# EAGLE design BP_protection_board (EAGLE 9.7.0)
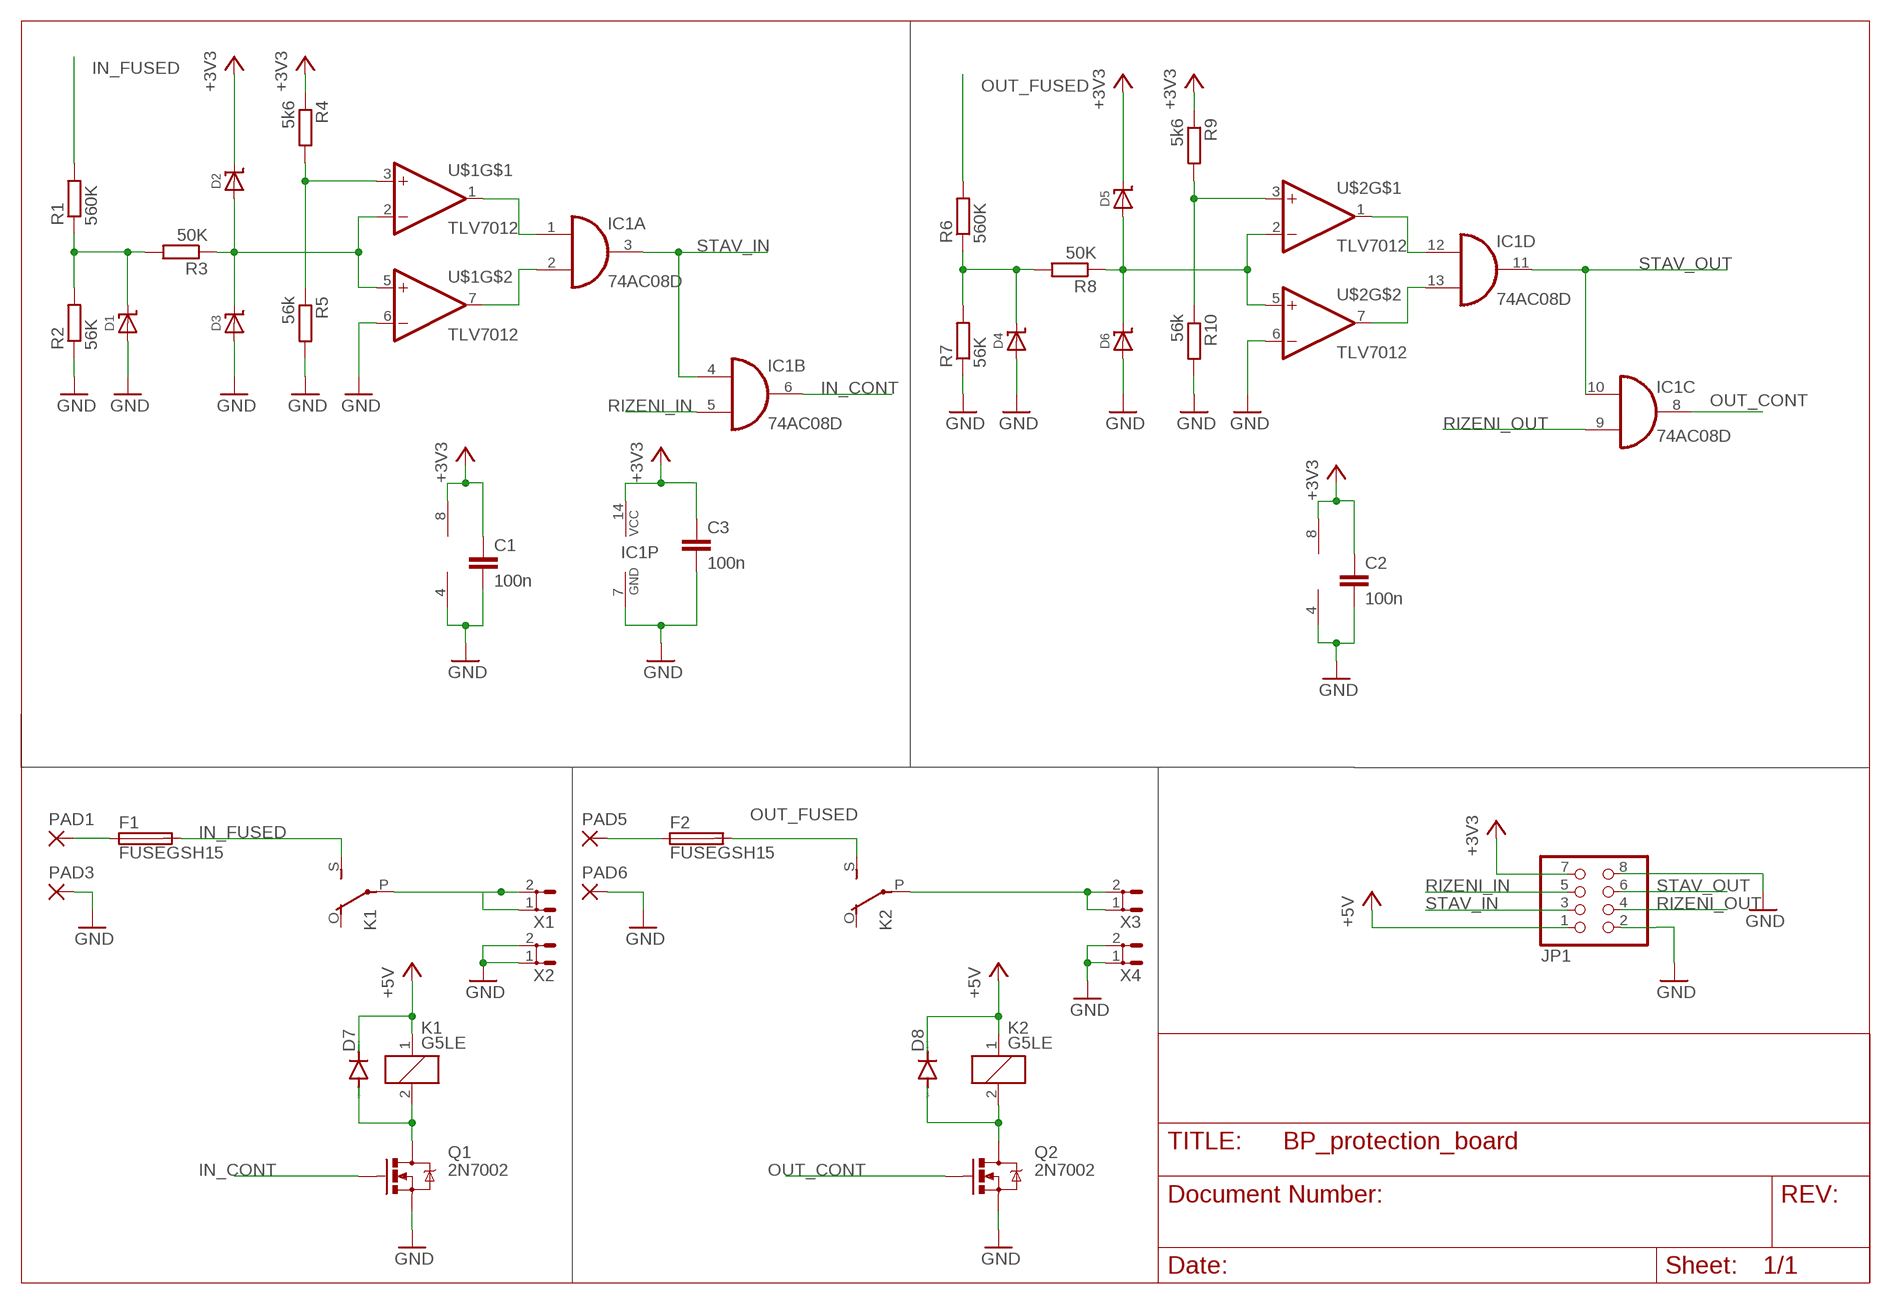
[diagram p0: schematic, sheet 1]

## Parts
C1  100n  C-EUC0805  [C0805]
C2  100n  C-EUC0805  [C0805]
C3  100n  C-EUC0805  [C0805]
D1  DIODE-SCHOTTKYSOD-123  [SOD-123]
D2  DIODE-SCHOTTKYSOD-123  [SOD-123]
D3  DIODE-SCHOTTKYSOD-123  [SOD-123]
D4  DIODE-SCHOTTKYSOD-123  [SOD-123]
D5  DIODE-SCHOTTKYSOD-123  [SOD-123]
D6  DIODE-SCHOTTKYSOD-123  [SOD-123]
D7  DIODE-MELF-MLL41  [MELF-MLL41]
D8  DIODE-MELF-MLL41  [MELF-MLL41]
F1  FUSEGSH15  [GSH15]
F2  FUSEGSH15  [GSH15]
IC1  74AC08D  [SO14]
JP1  PINHD-2X4  [2X04]
K1  G5LE  [G5LE]
K2  G5LE  [G5LE]
PAD1  2,54/1,0  [2,54/1,0]
PAD3  2,54/1,0  [2,54/1,0]
PAD5  2,54/1,0  [2,54/1,0]
PAD6  2,54/1,0  [2,54/1,0]
Q1  2N7002  MOSFET-NCHANNEL2N7002PW  [SOT323]
Q2  2N7002  MOSFET-NCHANNEL2N7002PW  [SOT323]
R1  560K  R-EU_R0805  [R0805]
R2  56K  R-EU_R0805  [R0805]
R3  50K  R-EU_R0805  [R0805]
R4  5k6  R-EU_R0805  [R0805]
R5  56k  R-EU_R0805  [R0805]
R6  560K  R-EU_R0805  [R0805]
R7  56K  R-EU_R0805  [R0805]
R8  50K  R-EU_R0805  [R0805]
R9  5k6  R-EU_R0805  [R0805]
R10  56k  R-EU_R0805  [R0805]
U$1  TLV7012  [SOT-23-THIN]
U$2  TLV7012  [SOT-23-THIN]
X1  ST6,3  [ST6,3]
X2  ST6,3  [ST6,3]
X3  ST6,3  [ST6,3]
X4  ST6,3  [ST6,3]

## Nets
+3V3: C1.1 C2.1 C3.1 D2.C D5.C IC1.14(P:VCC) JP1.7 R4.1 R9.1 U$1.8(V+) U$2.8(V+)
+5V: D7.C D8.C JP1.1 K1.1 K2.1
GND: C1.2 C2.2 C3.2 D1.A D3.A D4.A D6.A IC1.7(P:GND) JP1.2 JP1.8 PAD3.1(P) PAD6.1(P) Q1.2(S) Q2.2(S) R2.1 R5.2 R7.1 R10.2 U$1.4(V-) U$1.6(-IN) U$2.4(V-) U$2.6(-IN) X2.1 X2.2 X4.1 X4.2
IN_CONT: IC1.6(B:O) Q1.1(G)
IN_FUSED: F1.2 K1.S(2:S) R1.2
N$1: D1.C R1.1 R2.2 R3.2
N$2: D2.A D3.C R3.1 U$1.2(-IN) U$1.5(+IN)
N$3: R4.2 R5.1 U$1.3(+IN)
N$4: D4.C R6.1 R7.2 R8.2
N$5: F1.1 PAD1.1(P)
N$6: D5.A D6.C R8.1 U$2.2(-IN) U$2.5(+IN)
N$7: R9.2 R10.1 U$2.3(+IN)
N$8: K1.P(2:P) X1.1 X1.2
N$9: K2.P(2:P) X3.1 X3.2
N$10: D8.A K2.2 Q2.3(D)
N$11: D7.A K1.2 Q1.3(D)
N$12: IC1.1(A:I0) U$1.1(OUT)
N$13: IC1.2(A:I1) U$1.7(OUT)
N$14: F2.1 PAD5.1(P)
N$17: IC1.12(D:I0) U$2.1(OUT)
N$18: IC1.13(D:I1) U$2.7(OUT)
OUT_CONT: IC1.8(C:O) Q2.1(G)
OUT_FUSED: F2.2 K2.S(2:S) R6.2
RIZENI_IN: IC1.5(B:I1) JP1.5
RIZENI_OUT: IC1.9(C:I0) JP1.4
STAV_IN: IC1.3(A:O) IC1.4(B:I0) JP1.3
STAV_OUT: IC1.10(C:I1) IC1.11(D:O) JP1.6
Unconnected: K1.O(2:O) K2.O(2:O)

## Library data of the parts
C1-C3 = rcl:C-EU: CAPACITOR, European symbol; SPICEPREFIX: C
D1-D6 = Airquality_Sensor:DIODE-SCHOTTKY
D7 D8 = diode:DIODE-: DIODE
F1 F2 = fuse:FUSE: Fuse; OC_FARNELL: unknown; OC_NEWARK: unknown
IC1 = 74xx-eu:74*08: Quad 2-input AND gate
JP1 = pinhead:PINHD-2X4: PIN HEADER
K1 K2 = relay:G5LE: RELAY 1 x switch, 10 A/120 V AC, 8 A/30 V DC, Omron; OC_FARNELL: unknown; OC_NEWARK: unknown
PAD1 PAD3 PAD5 PAD6 = wirepad:2,54/1,0: THROUGH-HOLE PAD
Q1 Q2 = BeagleBone_Blue_R3:MOSFET-NCHANNEL: Common NMOSFET Parts MFG P/N Store ID Prod ID FDD8780 TRANS-09984 SI7820DN TRANS-11055 FDS6630A IC-08089 2N7002PW TRANS-11151 FQP30N06L COM-10213 TRANS-10060 BSS123LT1G TRANS-08345 BSS138 TRANS-00830 BS170 2N7000; PROD_ID: TRANS-11151
R1-R10 = rcl:R-EU_: RESISTOR, European symbol; SPICEPREFIX: R
U$1 U$2 = operacni_zesilovace:TLV7012
X1-X4 = con-rib:ST6,3: RIBBON CABLE CONNECTOR Flachstecker / Faston; OC_FARNELL: unknown; OC_NEWARK: unknown

## Board
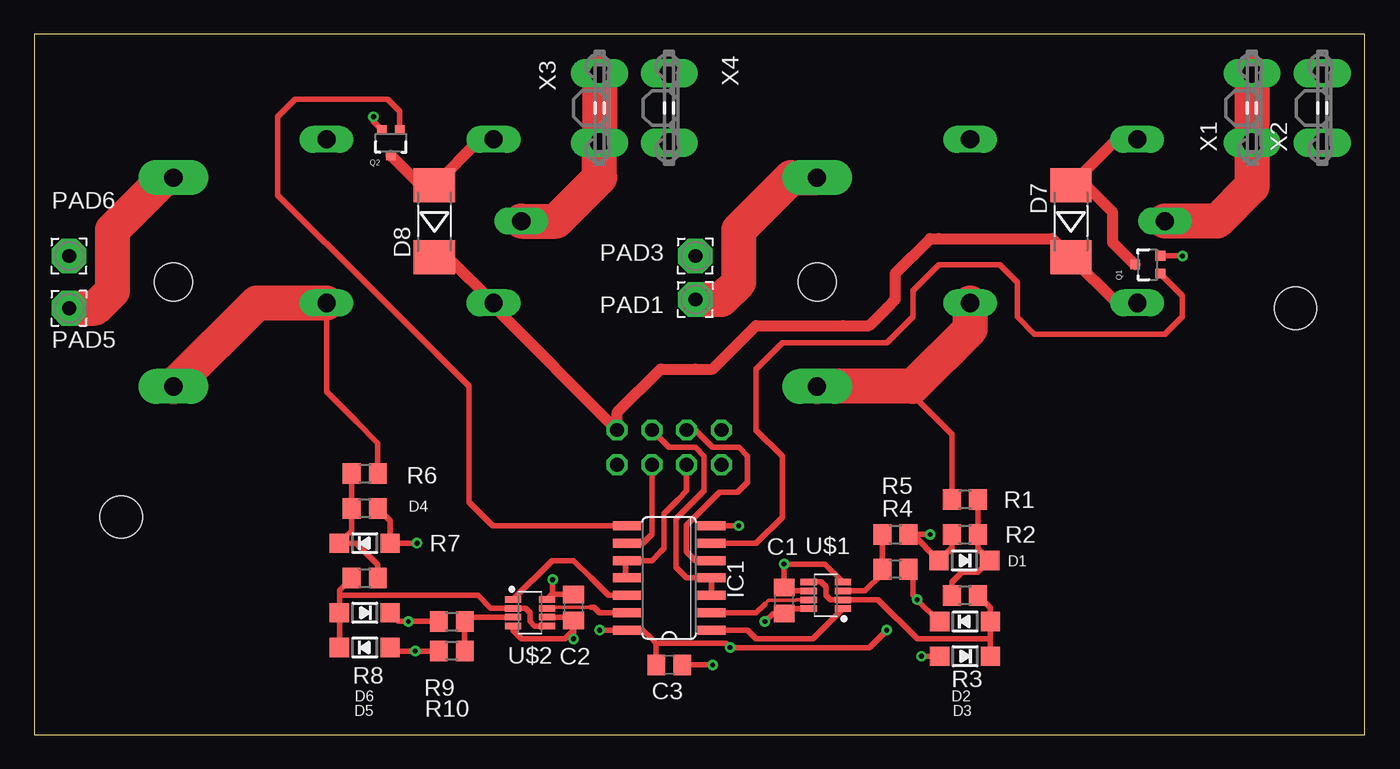
[diagram p1: board, top side]
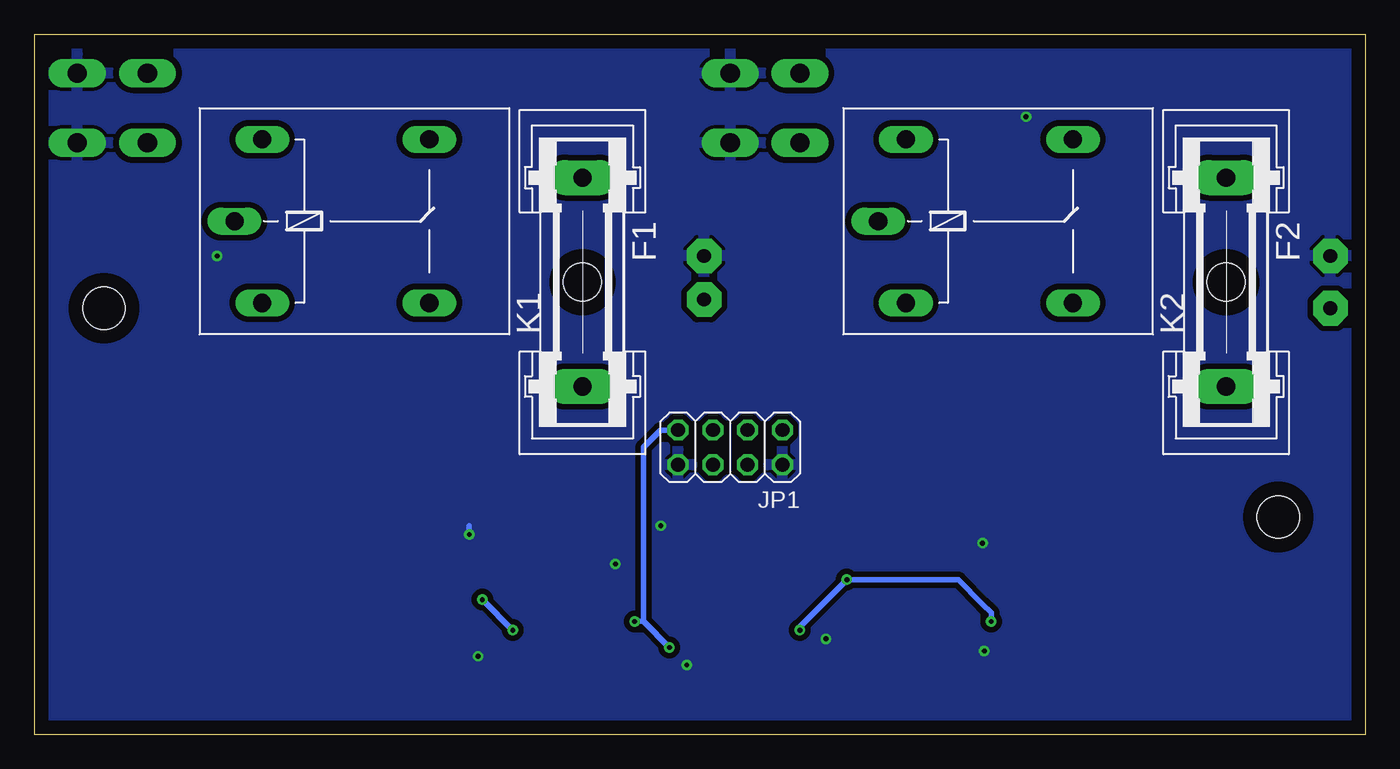
[diagram p2: board, bottom side, seen from below]

Size 97.14 x 51.1 mm. Coordinates in mm from the lower left corner, seen from the top.
Outline: 0,0 97.14,0 97.14,51.1 0,51.1 0,0
Copper layers (1*16): Top 0.035mm / dielectric 1.5mm / Bottom 0.035mm
Design rules "Fusion Electronics Design Rules": minimum track width 6mil, minimum drill 0.35mm, track to track 6mil, track to pad 6mil, pad to pad 6mil, via to via 6mil, smd to smd 6mil, copper to edge 40mil, drill to drill 6mil, minimum pad ring 10mil, minimum via ring 8mil, stop-mask expansion 4mil, vias tented up to drill 0mil, thermal gap 10mil
Holes 3.1 mm at 92.08,31.11 6.35,15.87

### Footprints (pad centres in the part's own frame; a part is rotated, then mirrored left to right if it is on the bottom)
C0805 = smd 1.3 x 1.5: 1 -0.95,0; 2 0.95,0
SOD-123 = smd 1.4 x 1.4: A 1.85,0; C -1.85,0
MELF-MLL41 = smd 2.5 x 3: A 2.625,0; C -2.625,0
GSH15 = drill 1.321 pad 2.54 long: 1 -7.62,0; 2 7.62,0 | hole 2.794: 0,0
SO14 = smd 0.66 x 2.032: 1 -3.81,-3.073; 2 -2.54,-3.073; 3 -1.27,-3.073; 4 0,-3.073; 5 1.27,-3.073; 6 2.54,-3.073; 7 3.81,-3.073; 8 3.81,3.073; 9 2.54,3.073; 10 1.27,3.073; 11 0,3.073; 12 -1.27,3.073; 13 -2.54,3.073; 14 -3.81,3.073
2X04 = drill 1.016 octagon: 1 -3.81,-1.27; 2 -3.81,1.27; 3 -1.27,-1.27; 4 -1.27,1.27; 5 1.27,-1.27; 6 1.27,1.27; 7 3.81,-1.27; 8 3.81,1.27
G5LE = drill 1.321 long: 1 -7.493,-5.969; 2 -7.493,5.969; O 4.699,5.969; P -9.525,0; S 4.699,-5.969
2,54/1,0 = drill 1.016 pad 2.54 octagon: 1 0,0
SOT323 = smd 0.7 x 0.7: 1 -0.65,-0.925; 2 0.65,-0.925; 3 0,0.925
R0805 = smd 1.3 x 1.5: 1 -0.95,0; 2 0.95,0
SOT-23-THIN = smd 1.18 x 0.478: 1 -1.246,0.975; 2 -1.246,0.325; 3 -1.246,-0.325; 4 -1.246,-0.975; 5 1.246,-0.975; 6 1.246,-0.325; 7 1.246,0.325; 8 1.246,0.975
ST6,3 = drill 1.397 long: 1 -2.54,0; 2 2.54,0

### Placement (x,y rotation side)
C1  54.74,9.78 90 top
C2  39.37,9.27 270 top
C3  46.36,5.08 0 top
D1  67.9,12.7 180 top
D2  67.95,8.25 0 top
D3  67.95,5.71 180 top
D4  24.13,13.97 0 top
D5  24.13,8.89 180 top
D6  24.13,6.35 0 top
D7  75.68,37.46 90 top
D8  29.21,37.46 90 top
F1  57.15,33.02 270 bottom
F2  10.16,33.02 270 bottom
IC1  46.36,11.43 90 top
JP1  46.36,20.96 180 bottom
K1  73.03,37.46 0 bottom
K2  26.04,37.46 0 bottom
PAD1  48.26,31.75 0 top
PAD3  48.26,34.92 0 top
PAD5  2.54,31.11 0 top
PAD6  2.54,34.92 0 top
Q1  81.28,34.29 90 top
Q2  26.04,43.18 180 top
R1  67.95,17.14 180 top
R2  67.95,14.61 0 top
R3  67.95,10.16 180 top
R4  62.87,12.07 180 top
R5  62.87,14.61 0 top
R6  24.13,19.05 0 top
R7  24.13,16.51 180 top
R8  24.13,11.43 0 top
R9  30.48,8.25 0 top
R10  30.48,6.1 180 top
U$1  57.78,10.16 180 top
U$2  36.2,8.89 0 top
X1  88.9,45.72 90 top
X2  94.02,45.72 90 top
X3  41.28,45.72 90 top
X4  46.36,45.72 90 top

### Tracks (layer width: path | path; a pad name or v marks a point on that pad's centre or on a via)
+3V3  (via drill 0.35)
  Top 0.406: U$1.8 55.09,9.18 C1.1 53.91,8.83 v53.34,8.25 | C3.1 45.41,6.67 45.4,6.67 | 45.4,6.67 45.09,6.99 44.45,7.62 IC1.14 v41.28,7.62 | R4.1 64.14,11.75 64.14,10.16 v64.45,9.84 66.04,8.25 D2.C | U$2.8 37.8,10.22 37.85,10.22 | C2.1 38.1,10.22 37.85,10.22 | R9.1 v27.3,8.25 26.62,8.25 D5.C | 45.4,6.67 50.48,6.67 v50.8,6.35 60.96,6.35 v62.23,7.62 | 37.85,10.22 v37.85,11.3
  Bottom 0.406: v50.8,6.35 52.7,8.25 | 52.7,8.25 v53.34,8.25 | v62.23,7.62 v64.45,9.84 | v41.28,7.62 41.28,7.87 v37.85,11.3 29.72,11.3 27.94,9.53 27.3,8.89 v27.3,8.25 | 52.7,8.25 52.7,20.32 52.7,20.96 51.44,22.22 JP1.7
+5V
  Top 0.813: D8.C 30.18,34.84 K2.1 33.53,31.24 JP1.1 42.55,23.5 42.6,23.55 45.72,26.67 48.26,26.67 49.53,26.67 52.7,29.85 59.06,29.85 60.96,29.85 62.23,31.11 62.87,31.75 62.87,33.66 65.41,36.19 66.04,36.19 74.32,36.19 D7.C 79.02,31.5 K1.1
GND  (via drill 0.35)
  Top 0.406: U$1.6 54.98,10.49 C1.2 v54.74,12.45 57.72,12.45 U$1.4 | R2.1 67,13.64 D1.A 64.14,14.61 R5.2 v65.41,14.61 | v51.44,15.24 IC1.7 | U$2.6 39.13,8.57 C2.2 | R7.1 25.98,15.61 D4.A v27.94,13.97 | R10.2 v27.81,6.1 26.23,6.1 D6.A | U$2.4 34.95,7.6 35.56,6.99 38.73,6.99 39.37,7.62 C2.2 | Q1.2 83.81,34.94 v83.82,34.92 | C3.2 v49.53,5.08 | C2.2 v39.37,6.99 | Q2.2 24.77,44.72 v24.77,45.08 | D3.A v64.77,5.71
  Bottom 0.406: v65.41,14.61 65.41,15.24
  pour Bottom (isolate 0.406): 1.04,0.41 97.38,0.41 97.38,50.39 1.04,50.39
IN_CONT
  Top 0.406: Q1.1 83.82,32.03 83.82,31.11 83.82,30.48 82.55,29.21 75.56,29.21 73.03,29.21 71.75,30.48 71.75,33.02 70.48,34.29 66.04,34.29 64.14,32.39 64.14,30.48 62.23,28.57 61.59,28.57 56.52,28.57 54.61,28.57 52.7,26.67 52.7,24.13 52.7,22.22 54.61,20.32 54.61,15.87 52.7,13.97 IC1.6
IN_FUSED
  Top 0.406: 64.14,25.4 64.14,24.76 66.04,22.86 67,21.9 R1.2
  Top 2.54: K1.S 68.33,29.59 64.14,25.4 F1.2
N$1
  Top 0.406: R1.1 R2.2 68.89,13.55 D1.C 68.89,11.85 67.73,11.85 67.31,11.43 67,11.11 R3.2
N$2
  Top 0.406: U$1.5 57.45,11.14 57.78,10.79 57.78,10.16 58.11,9.83 U$1.2 61.61,9.83 64.46,6.99 67.95,6.99 69.8,6.99 | R3.1 69.8,9.26 D2.A 69.8,6.99 | 69.8,6.99 D3.C
N$3
  Top 0.406: U$1.3 60.65,10.49 61.92,11.75 R4.2 R5.1
N$4
  Top 0.406: R8.2 25.08,12.39 24.77,12.7 23.5,13.97 D4.C 23.18,14.87 R7.2 R6.1
N$5
  Top 2.54: PAD1.1 50.16,31.75 51.44,33.02 51.44,36.83 55.25,40.64 F1.1
N$6
  Top 0.406: U$2.5 36.54,7.92 36.2,8.25 36.2,8.89 35.87,9.21 U$2.2 33.33,9.21 32.39,10.16 31.59,10.16 27.3,10.16 22.28,10.16 | D6.C D5.A 22.28,10.16 | 22.28,10.16 22.28,10.53 R8.1
N$7
  Top 0.406: R10.1 R9.2 31.74,8.57 33.97,8.57 U$2.3
N$8
  Top 2.54: X1.2 X1.1 88.9,40 86.36,37.46 K1.P
N$9
  Top 2.54: K2.P 38.1,37.46 41.28,40.64 X3.1 X3.2
N$10
  Top 0.813: K2.2 32.55,43.43 D8.A 28.2,40.09 Q2.3
N$11
  Top 0.813: K1.2 79.02,43.43 D7.A 75.76,40 76.2,40 76.84,40 78.74,38.1 78.74,35.91 Q1.3
N$12
  Top 0.406: IC1.1 52.07,7.62 52.7,6.99 56.83,6.99 U$1.1
N$13
  Top 0.254: U$1.7 55.64,9.83 55.6,9.8 53.62,9.8 53.34,9.53
  Top 0.406: 53.34,9.53 52.7,8.89 IC1.2
N$14
  Top 2.54: PAD5.1 4.45,31.11 5.72,32.39 5.72,36.83 9.53,40.64 F2.1
N$17
  Top 0.406: U$2.1 37.78,12.7 38.73,12.7 39.37,12.7 40.64,11.43 41.91,10.16 IC1.12
N$18
  Top 0.254: U$2.7 37.52,9.29 39.37,9.29 40.01,9.29 40.64,9.29 40.87,9.29
  Top 0.406: 40.64,9.29 40.87,9.29 41.28,8.89 IC1.13
OUT_CONT
  Top 0.406: IC1.8 33.45,15.24 31.75,16.94 31.75,17.78 31.75,25.4 24.77,32.39 17.78,39.37 17.78,41.27 17.78,45.08 19.05,46.35 25.8,46.35 26.69,45.47 Q2.1
OUT_FUSED
  Top 0.406: R6.2 25.08,21.28 23.5,22.86 21.34,25.02 K2.S
  Top 2.54: F2.2 16.26,31.5 K2.S
RIZENI_IN
  Top 0.406: IC1.5 48.26,12.7 47.62,13.33 47.62,15.29 50.02,17.68 51.34,17.68 52.07,18.42 52.07,19.68 52.07,20.32 51.44,20.96 49.53,20.96 48.26,22.22 JP1.5
RIZENI_OUT
  Top 0.406: IC1.9 44.45,13.97 45.09,14.61 45.09,15.87 JP1.4
STAV_IN
  Top 0.406: IC1.3 IC1.4 47.62,11.43 46.86,12.19 46.86,15.75 47.62,16.51 48.9,17.78 48.9,18.42 48.9,20.32 48.26,20.96 47.62,20.96 46.36,20.96 JP1.3
STAV_OUT
  Top 0.406: IC1.10 45.09,12.7 45.72,13.33 45.97,13.59 45.97,15.24 45.97,16.13 46.99,17.14 47.62,17.78 JP1.6 | 43.18,12.7 42.55,12.7 43.18,12.7 | 43.18,12.7 IC1.10 | IC1.10 43.18,12.7 | IC1.11 43.18,11.53 43.18,12.7